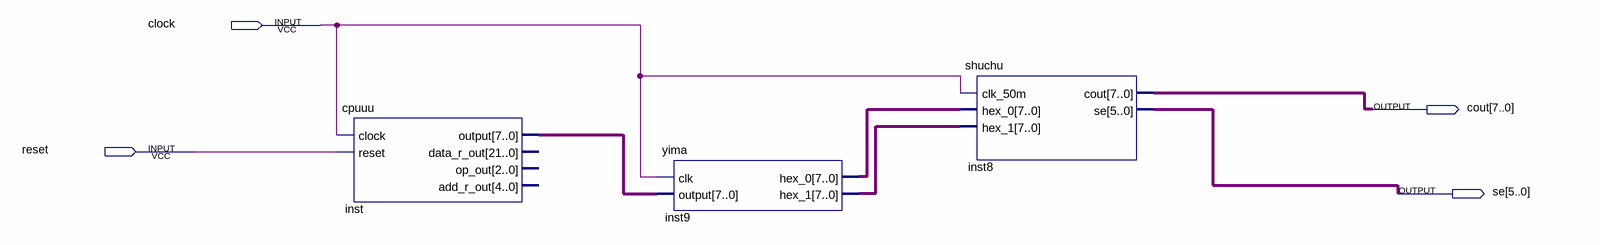
[diagram p0: schematic sheet]
// Quartus schematic cpu.bdf as structural Verilog: 3 symbols, 4 pins
module cpu (
  input  clock,
  input  reset,
  output [7:0] cout,
  output [5:0] se
);

  wire [7:0] inst9_hex_0, inst9_hex_1, inst_output;

  cpuuu inst (.clock(clock), .reset(reset), .\output (inst_output));  // open: data_r_out, op_out, add_r_out
  yima inst9 (.clk(clock), .\output (inst_output), .hex_0(inst9_hex_0), .hex_1(inst9_hex_1));
  shuchu inst8 (.clk_50m(clock), .hex_0(inst9_hex_0), .hex_1(inst9_hex_1), .cout(cout), .se(se));
endmodule
